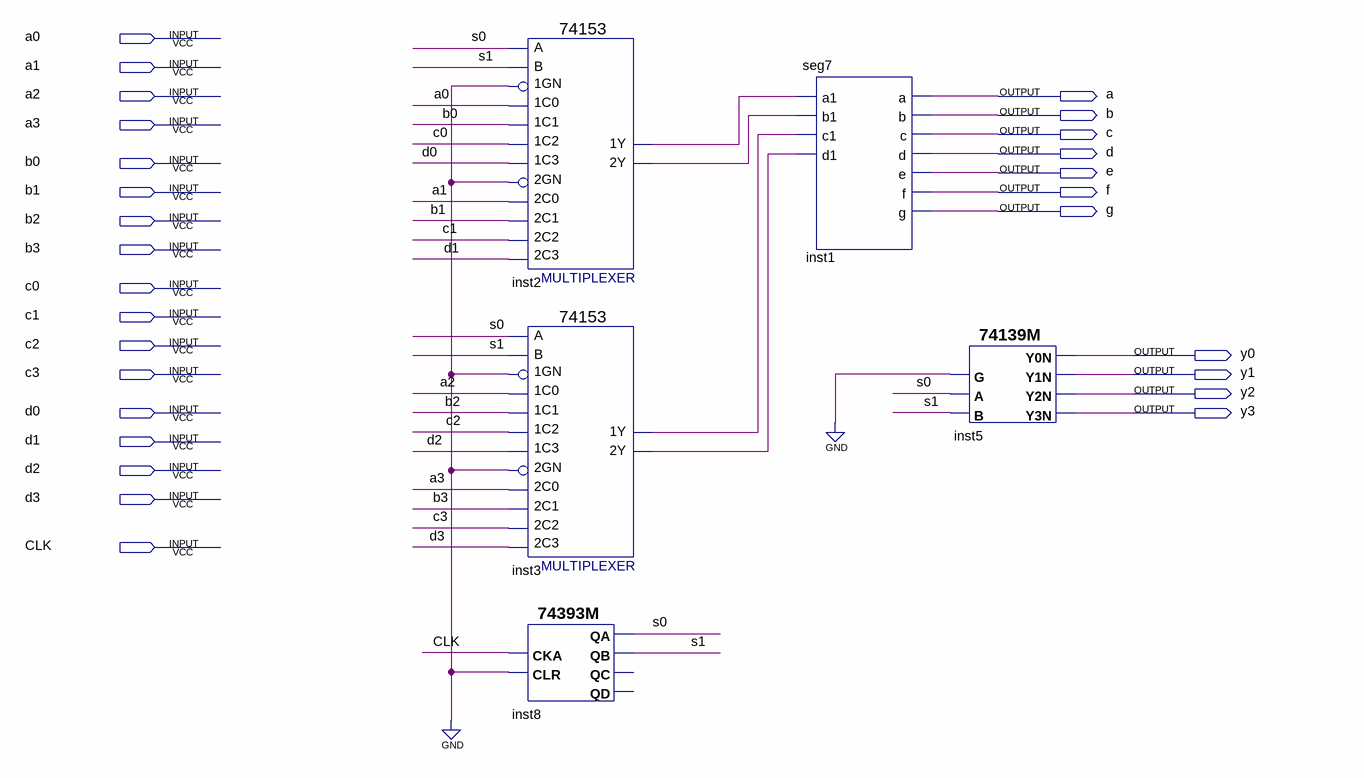
[diagram p0: schematic sheet]
// Quartus schematic 4xLED_mod.bdf as structural Verilog: 5 symbols, 28 pins
module \4xLED_mod  (
  input  a0,
  input  a1,
  input  a2,
  input  a3,
  input  b0,
  input  b1,
  input  b2,
  input  b3,
  input  c0,
  input  c1,
  input  c2,
  input  c3,
  input  d0,
  input  d1,
  input  d2,
  input  d3,
  input  CLK,
  output a,
  output b,
  output c,
  output d,
  output e,
  output f,
  output g,
  output y0,
  output y1,
  output y2,
  output y3
);

  wire inst2_1y, inst2_2y, inst3_1y, inst3_2y, s0, s1;

  \74153  inst2 (
    .\1C1 (b0), .\1GN (1'b0), .\1C0 (a0), .\2C0 (a1), .\2GN (1'b0), .\2C2 (c1), .\1C2 (c0), .\1C3 (d0),
    .B(s1), .A(s0), .\2C1 (b1), .\2C3 (d1), .\1Y (inst2_1y), .\2Y (inst2_2y));
  \74153  inst3 (
    .\1C1 (b2), .\1GN (1'b0), .\1C0 (a2), .\2C0 (a3), .\2GN (1'b0), .\2C2 (c3), .\1C2 (c2), .\1C3 (d2),
    .B(s1), .A(s0), .\2C1 (b3), .\2C3 (d3), .\1Y (inst3_1y), .\2Y (inst3_2y));
  \74393M  inst8 (.CLR(1'b0), .CKA(CLK), .QB(s1), .QA(s0));  // open: QC, QD
  seg7 inst1 (
    .a1(inst2_1y), .b1(inst2_2y), .c1(inst3_1y), .d1(inst3_2y), .a(a), .b(b), .c(c), .d(d), .e(e), .f(f),
    .g(g));
  \74139M  inst5 (.B(s1), .A(s0), .G(1'b0), .Y3N(y3), .Y2N(y2), .Y0N(y0), .Y1N(y1));
endmodule
